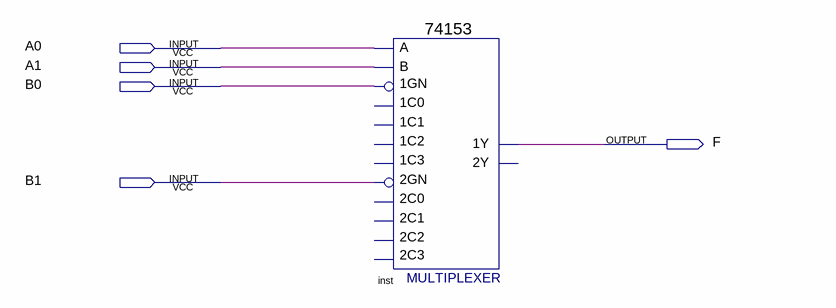
[diagram p0: schematic sheet]
// Quartus schematic Block2.bdf as structural Verilog: 1 symbols, 5 pins
module Block2 (
  input  A0,
  input  A1,
  input  B0,
  input  B1,
  output F
);

  \74153  inst (.\1GN (B0), .\2GN (B1), .B(A1), .A(A0), .\1Y (F));  // open: 1C1, 1C0, 2C0, 2C2, 1C2, 1C3, 2C1, 2C3, 2Y
endmodule
